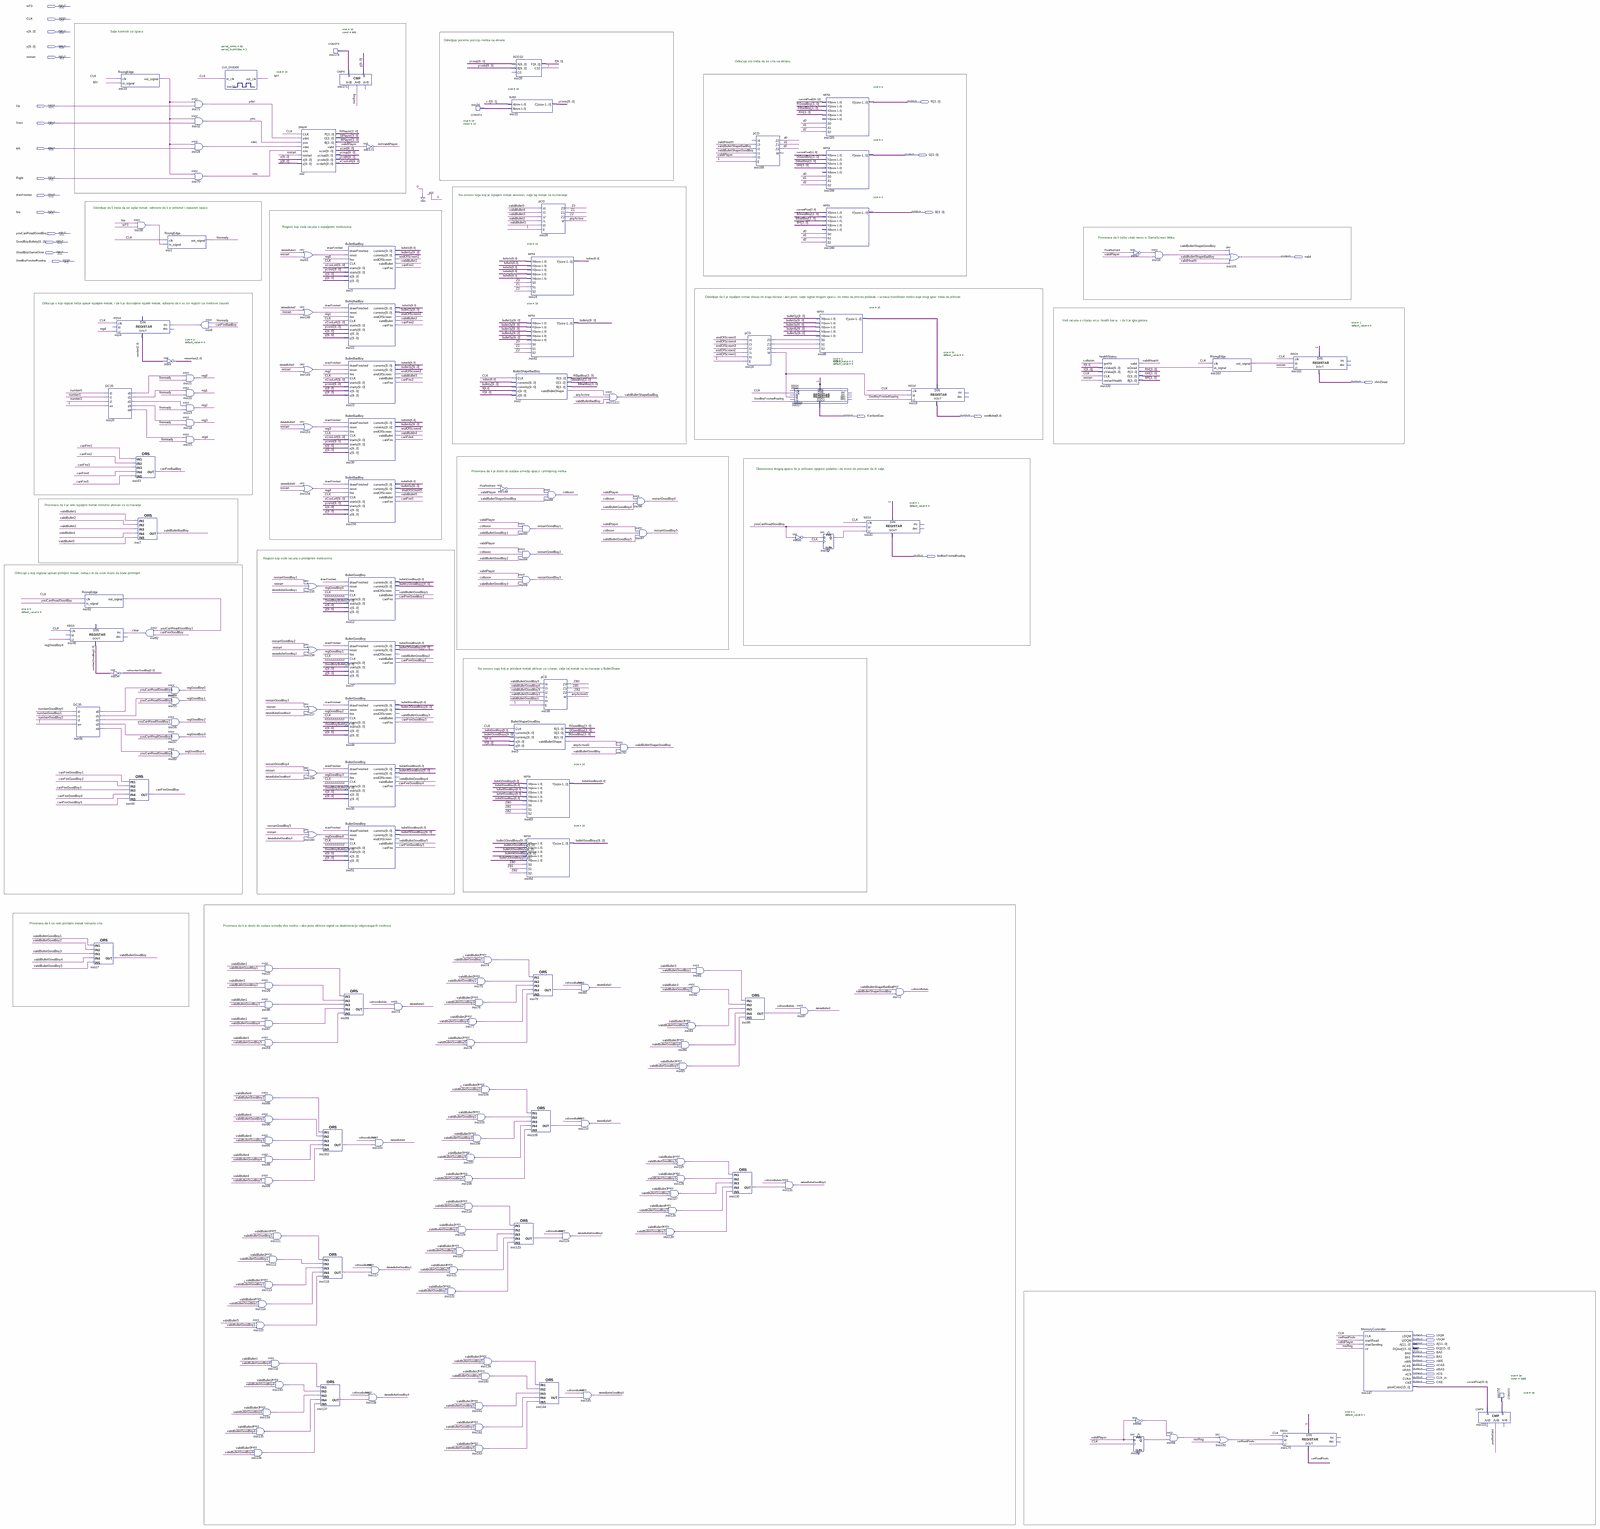
[diagram p0: schematic sheet, whole]
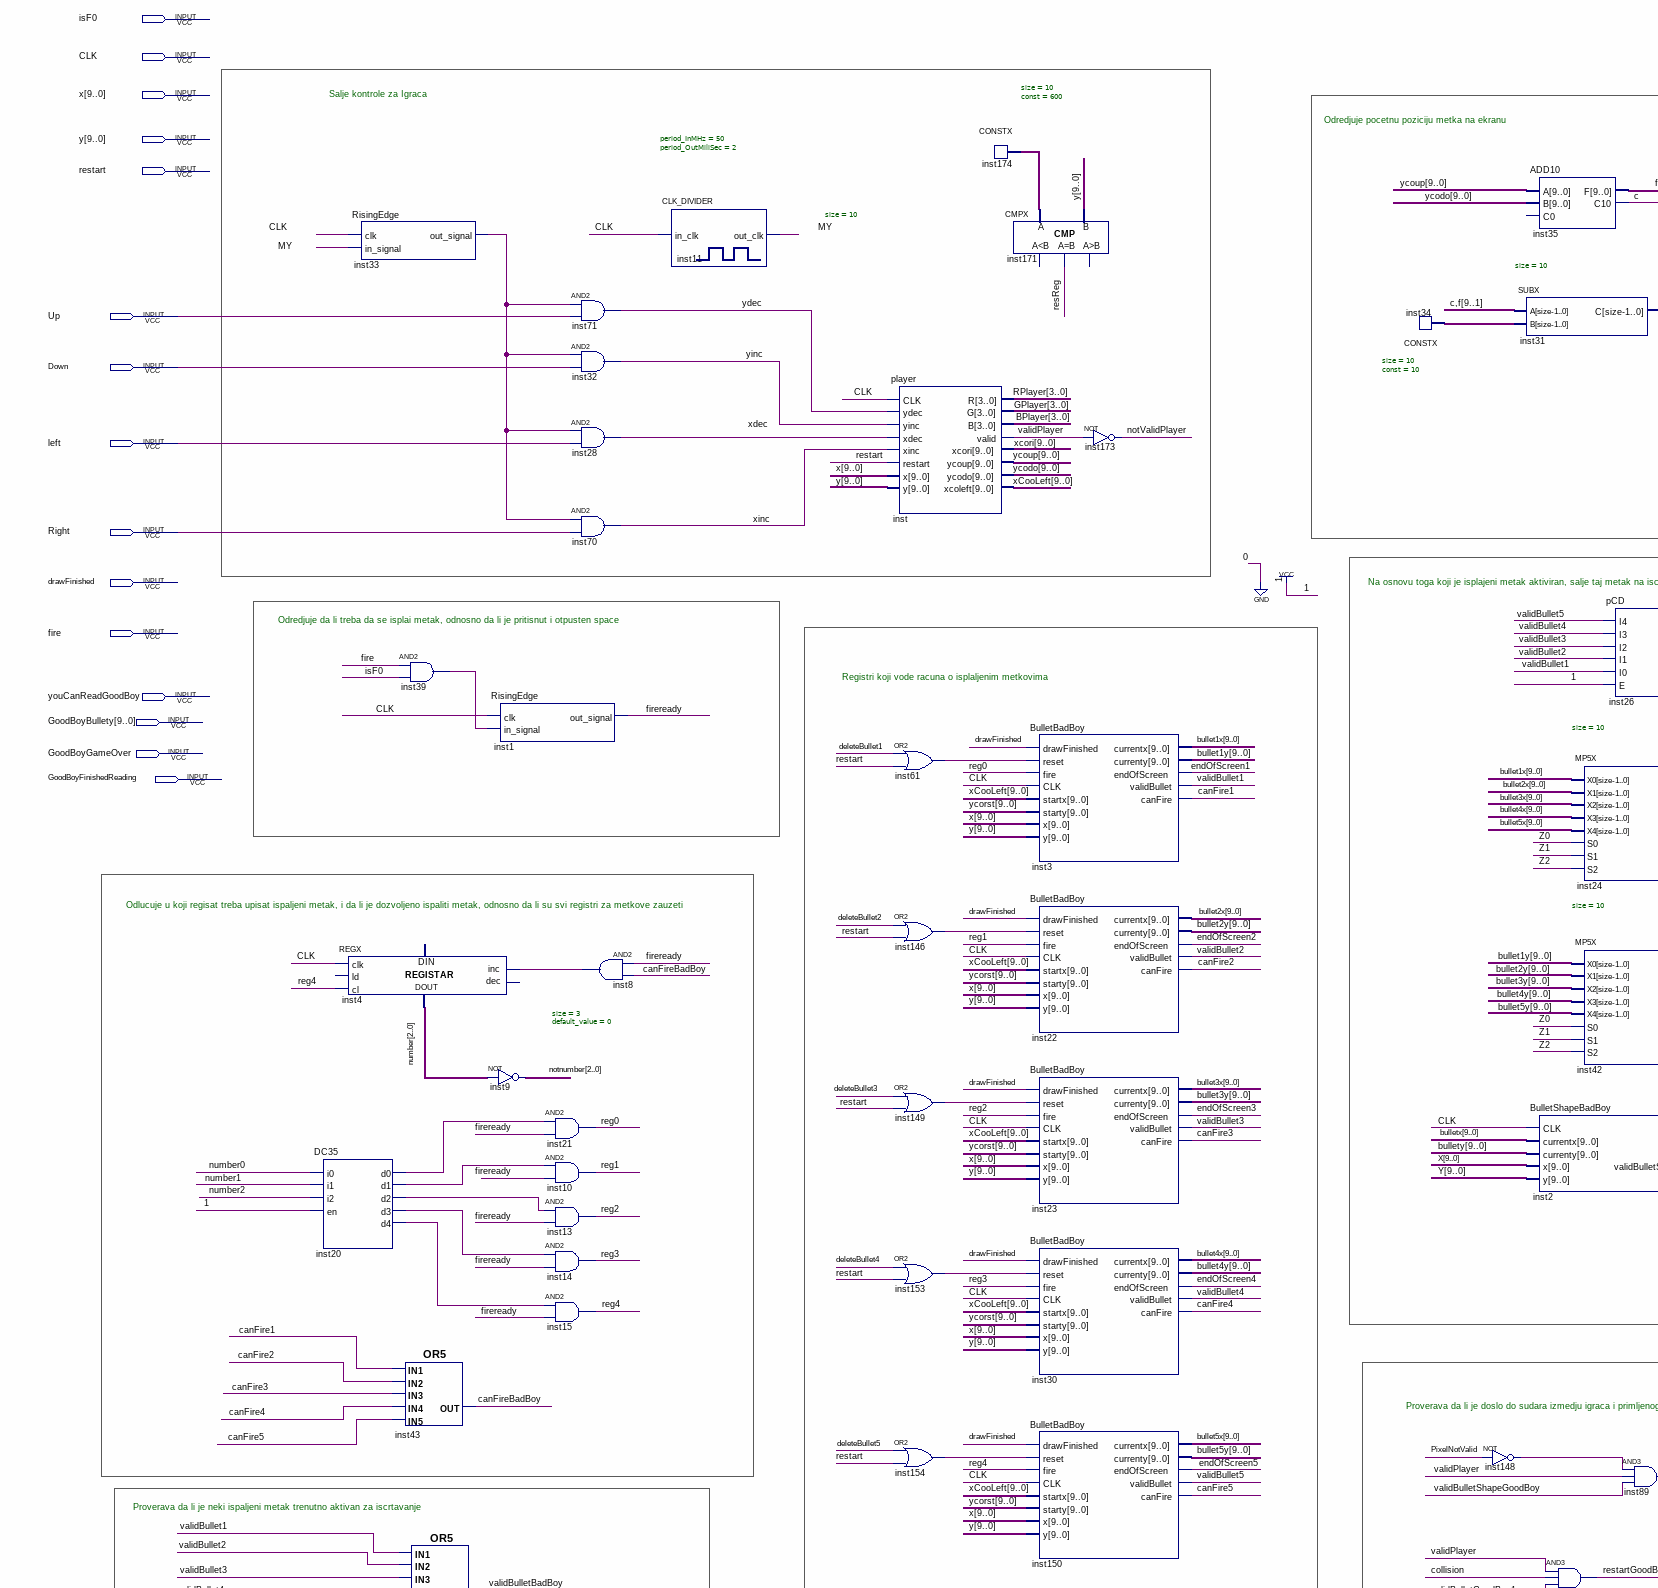
[diagram p1: schematic sheet, upper left part]
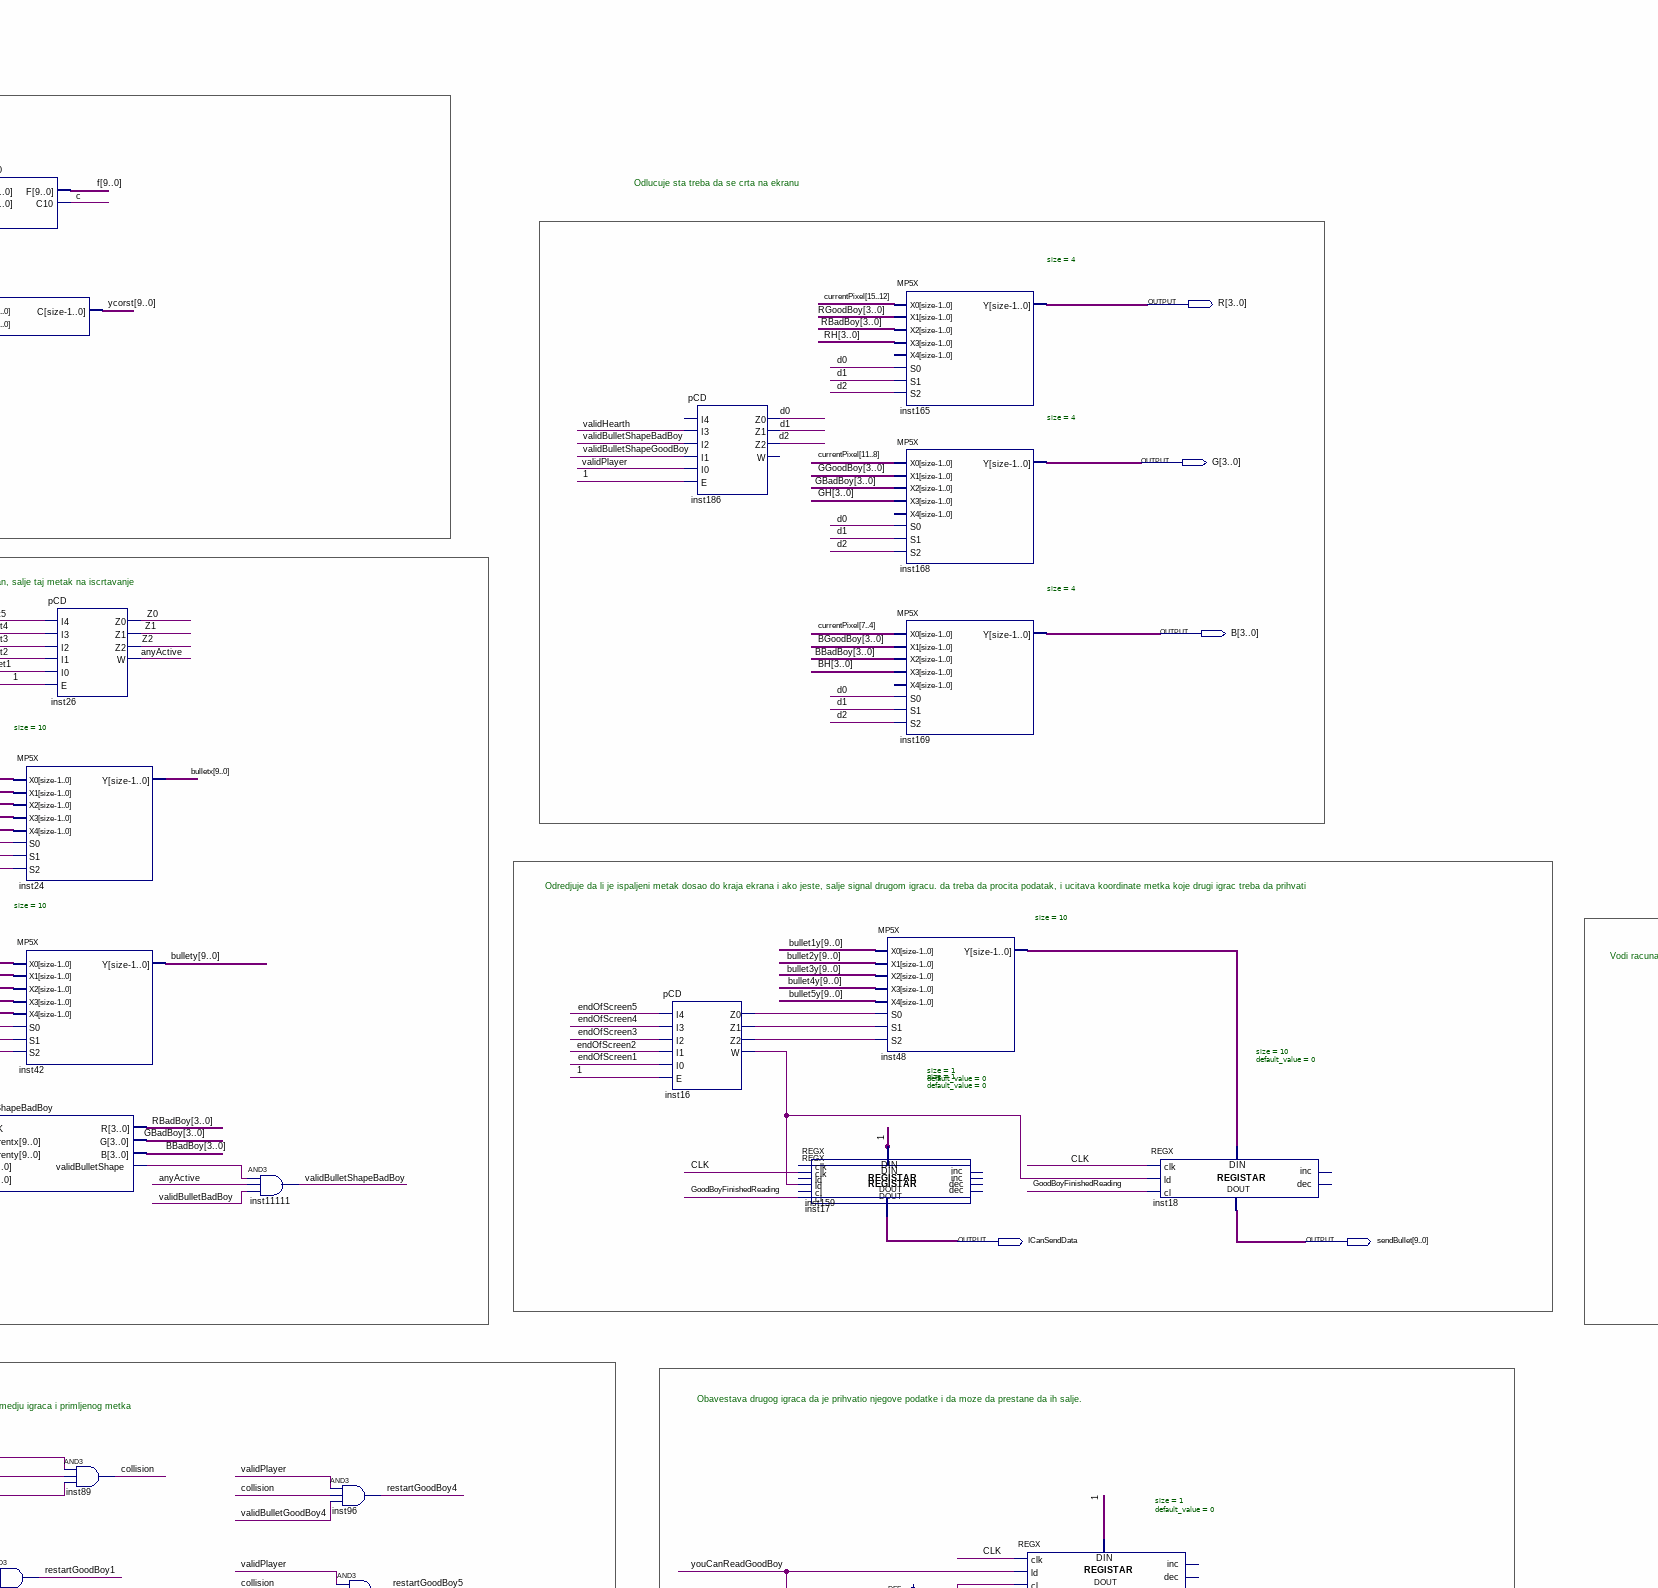
[diagram p2: schematic sheet, upper centre part]
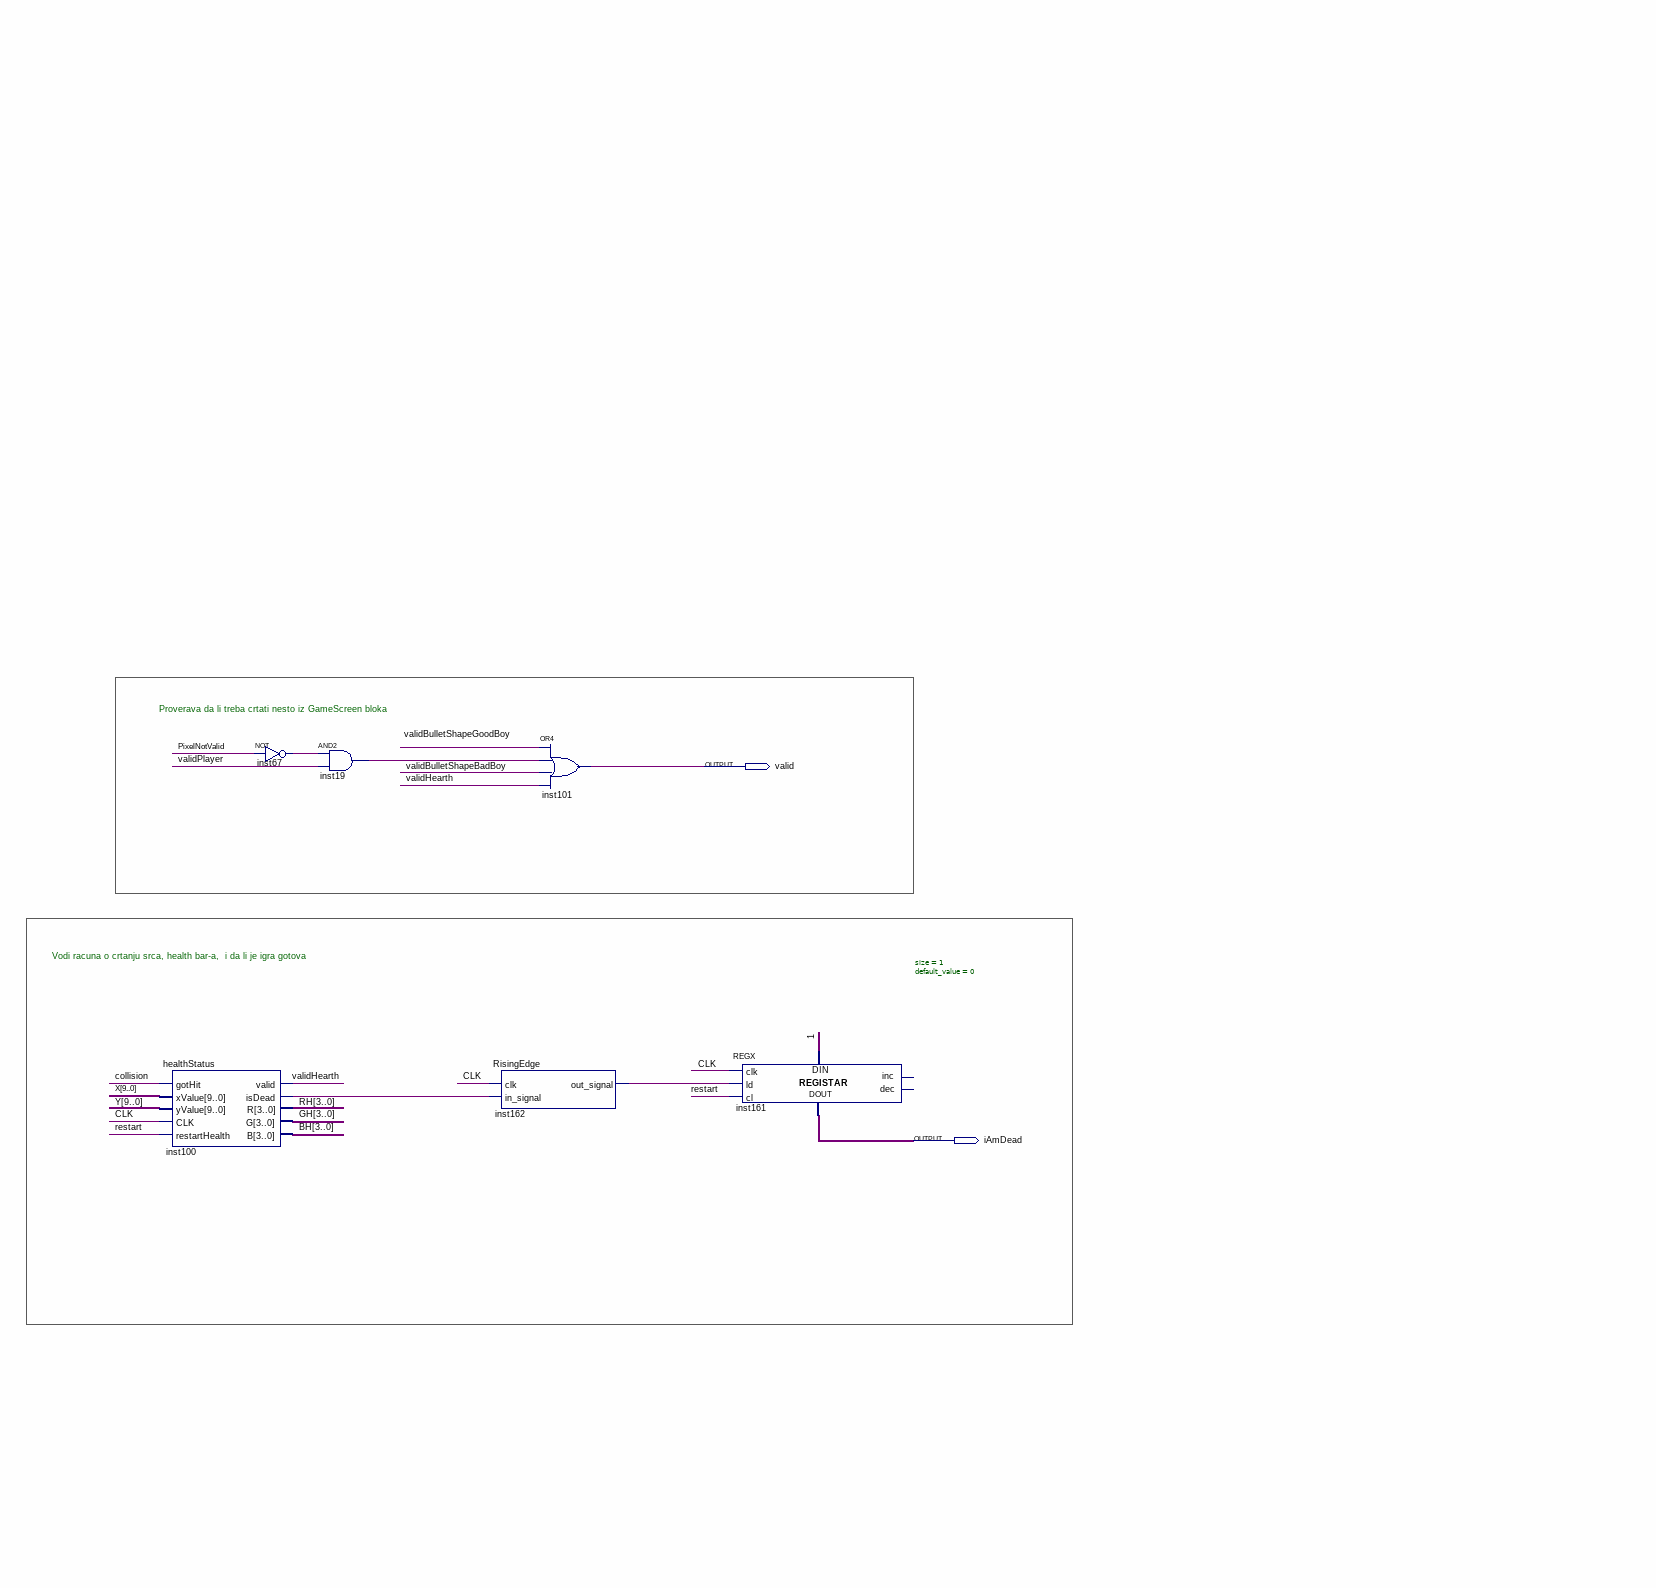
[diagram p3: schematic sheet, upper right part]
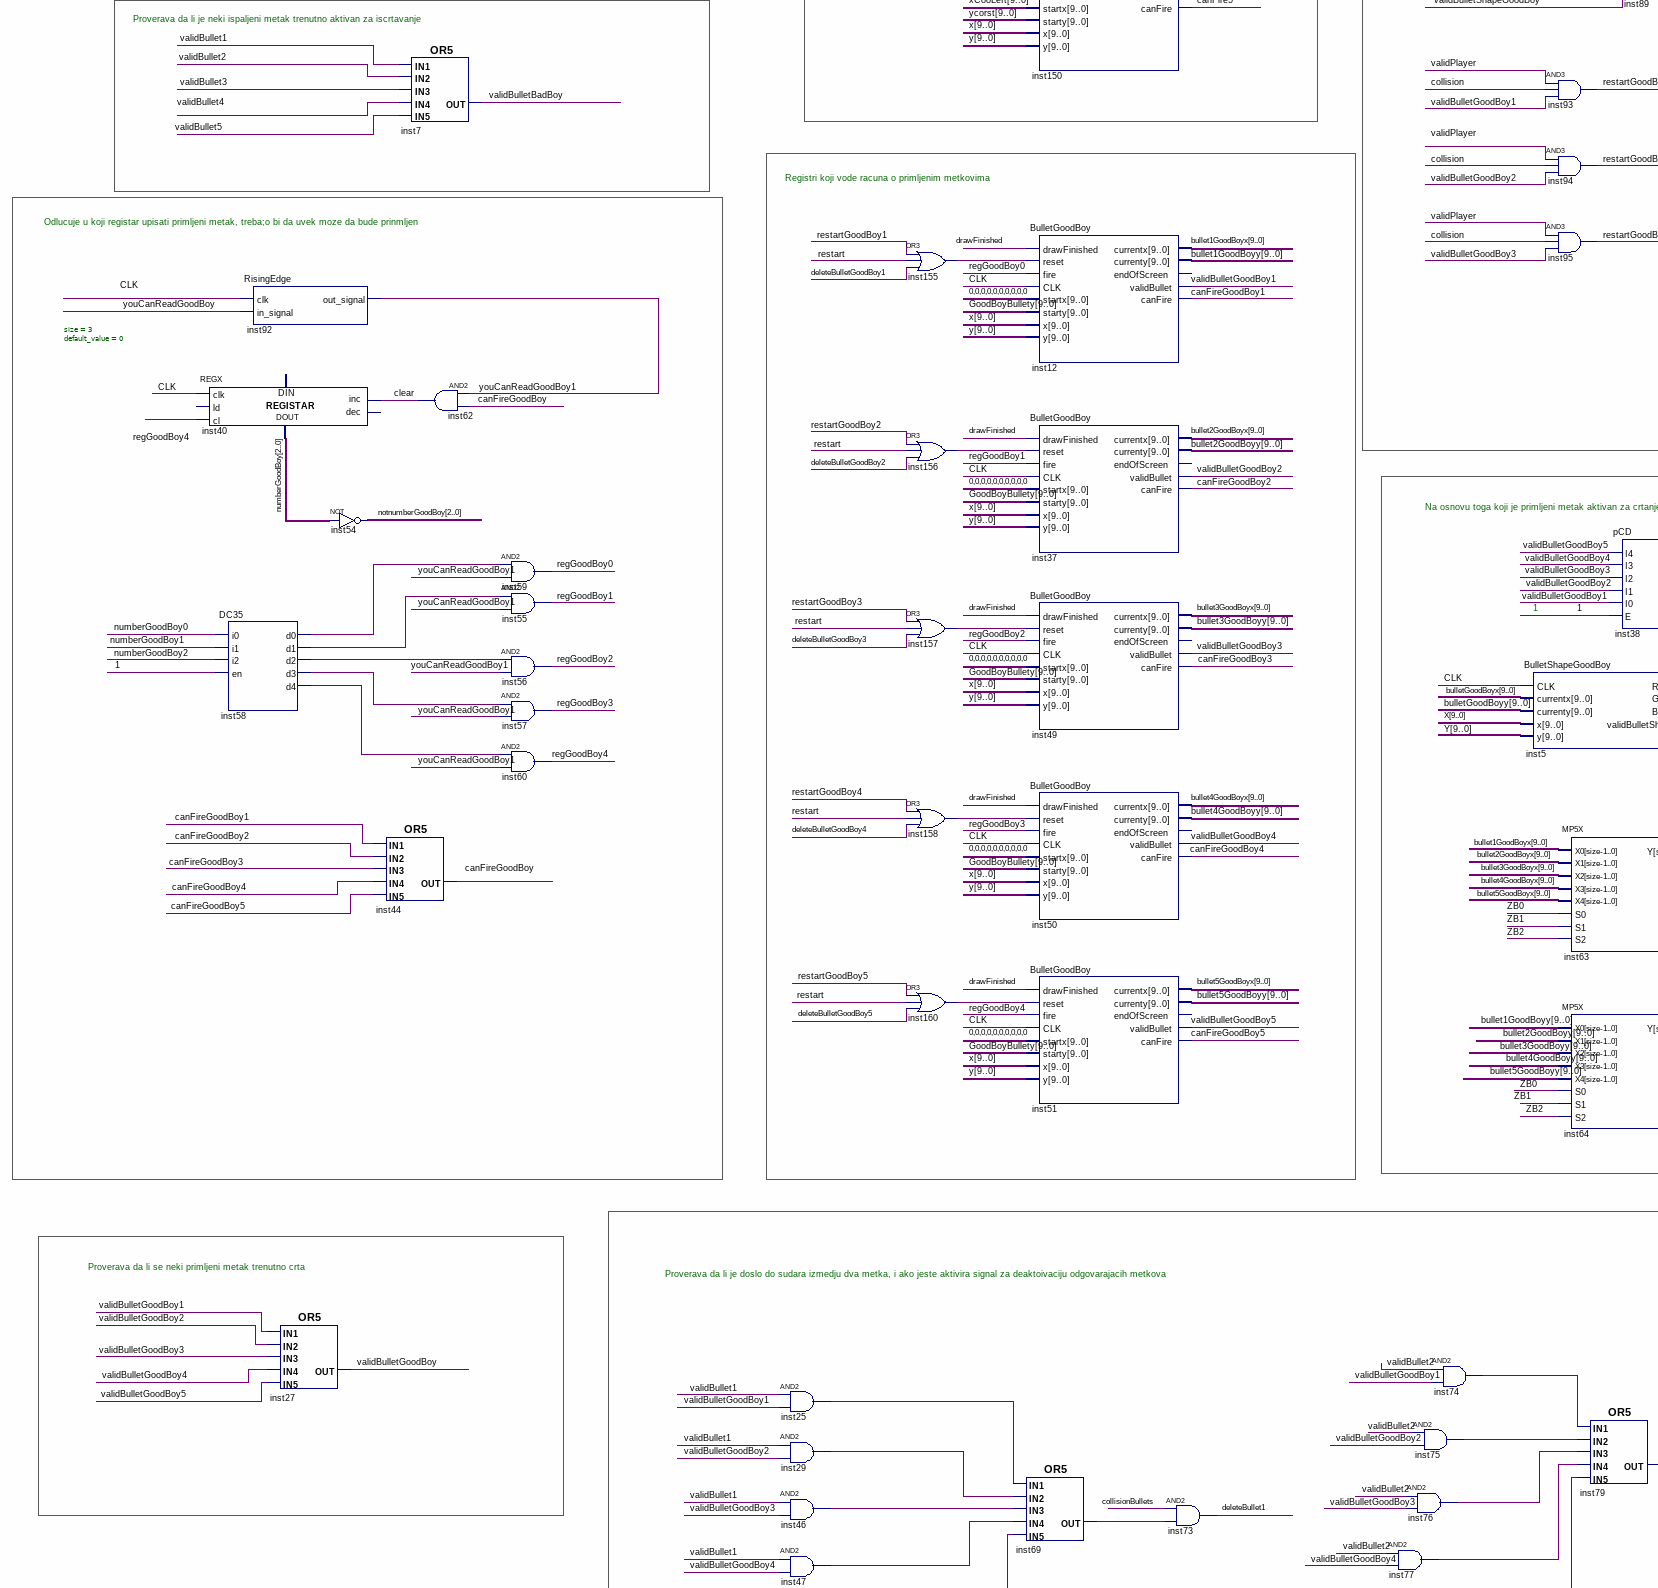
[diagram p4: schematic sheet, middle left part]
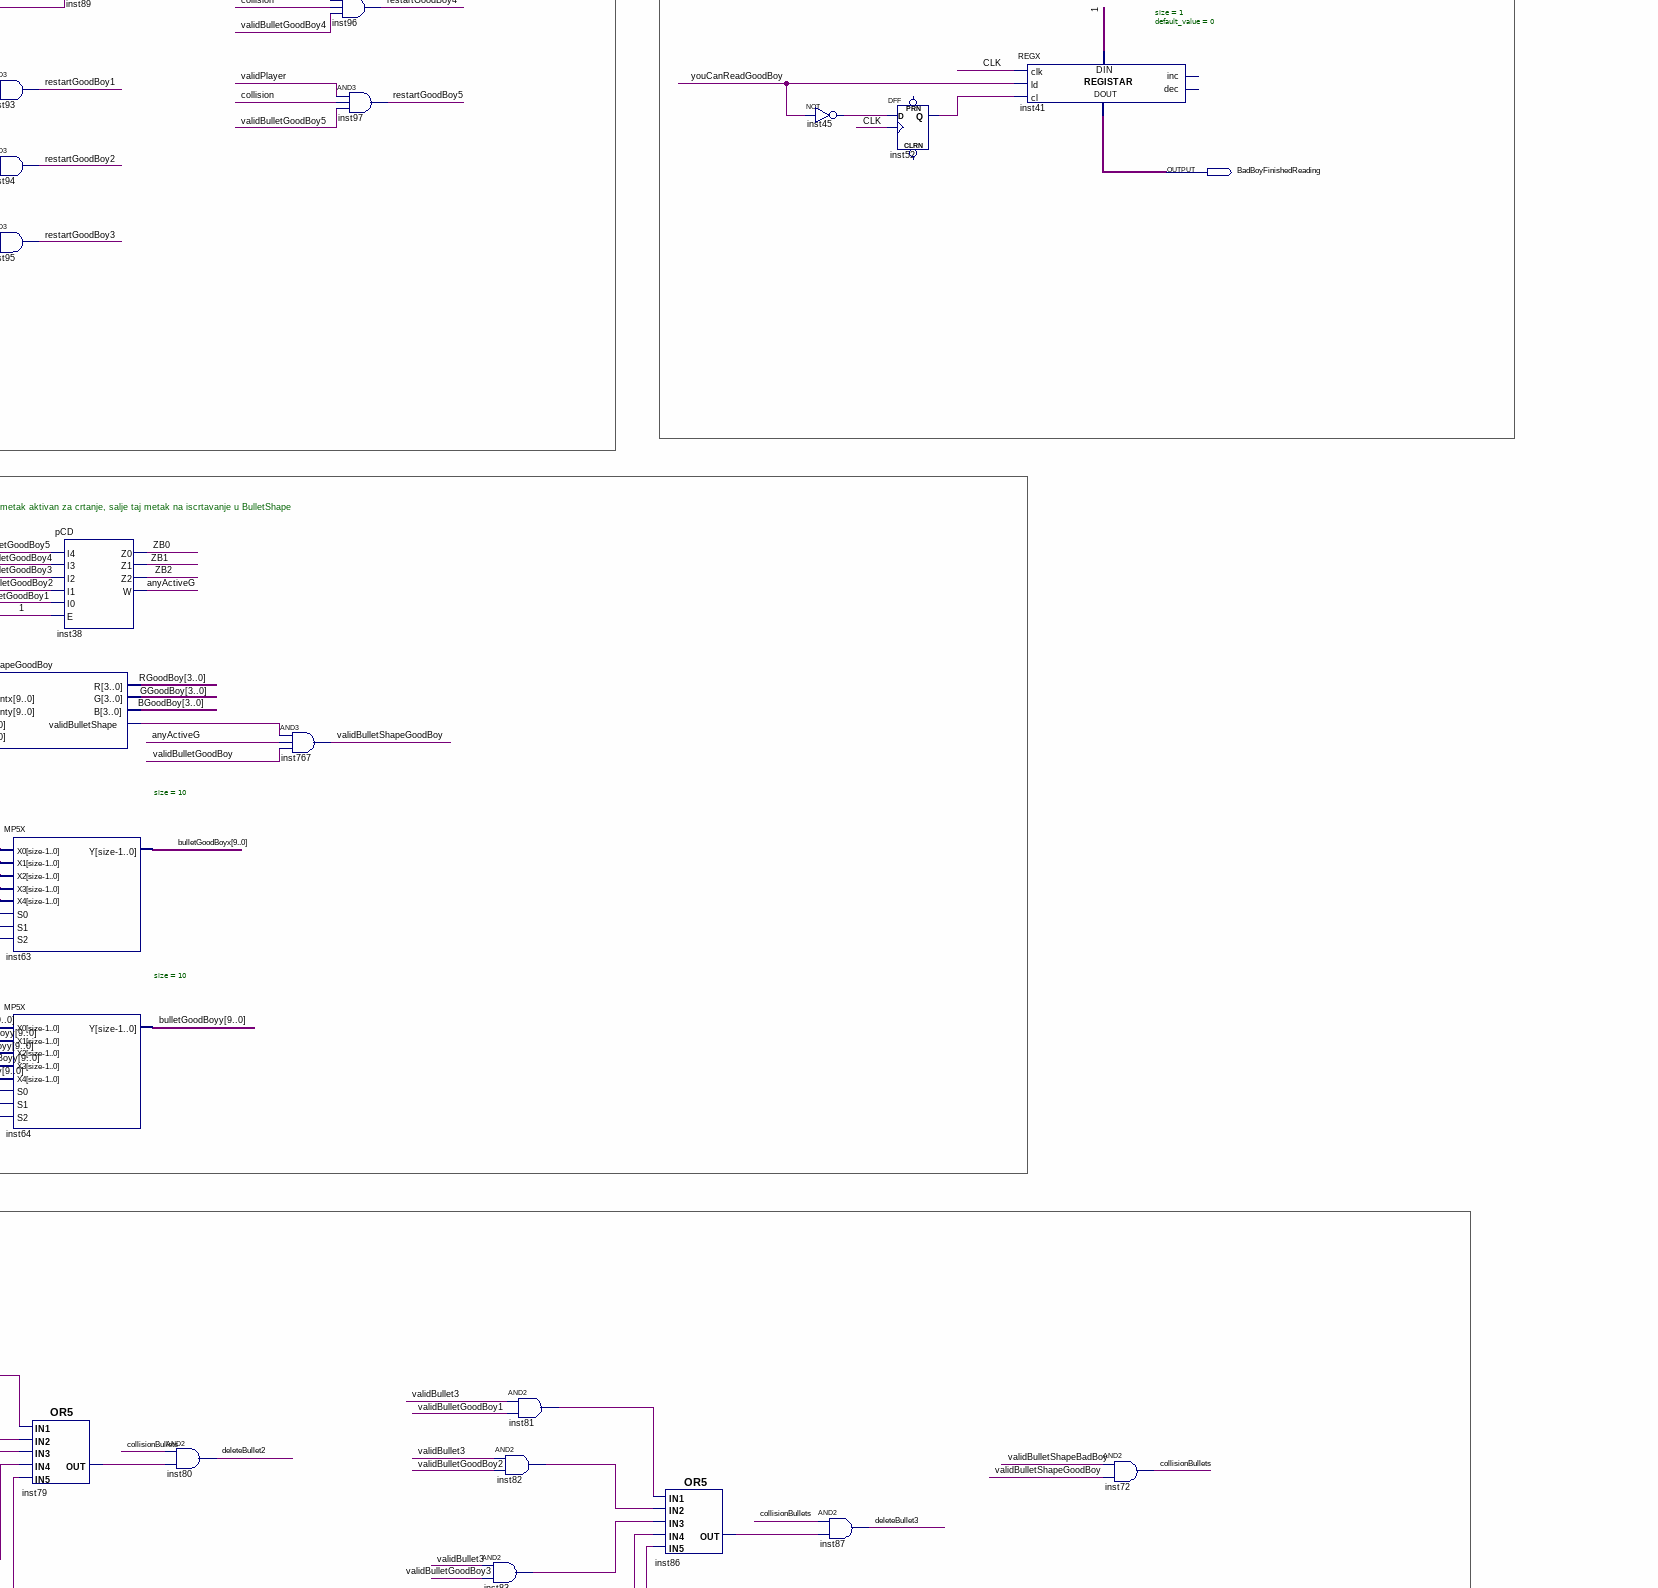
[diagram p5: schematic sheet, middle centre part]
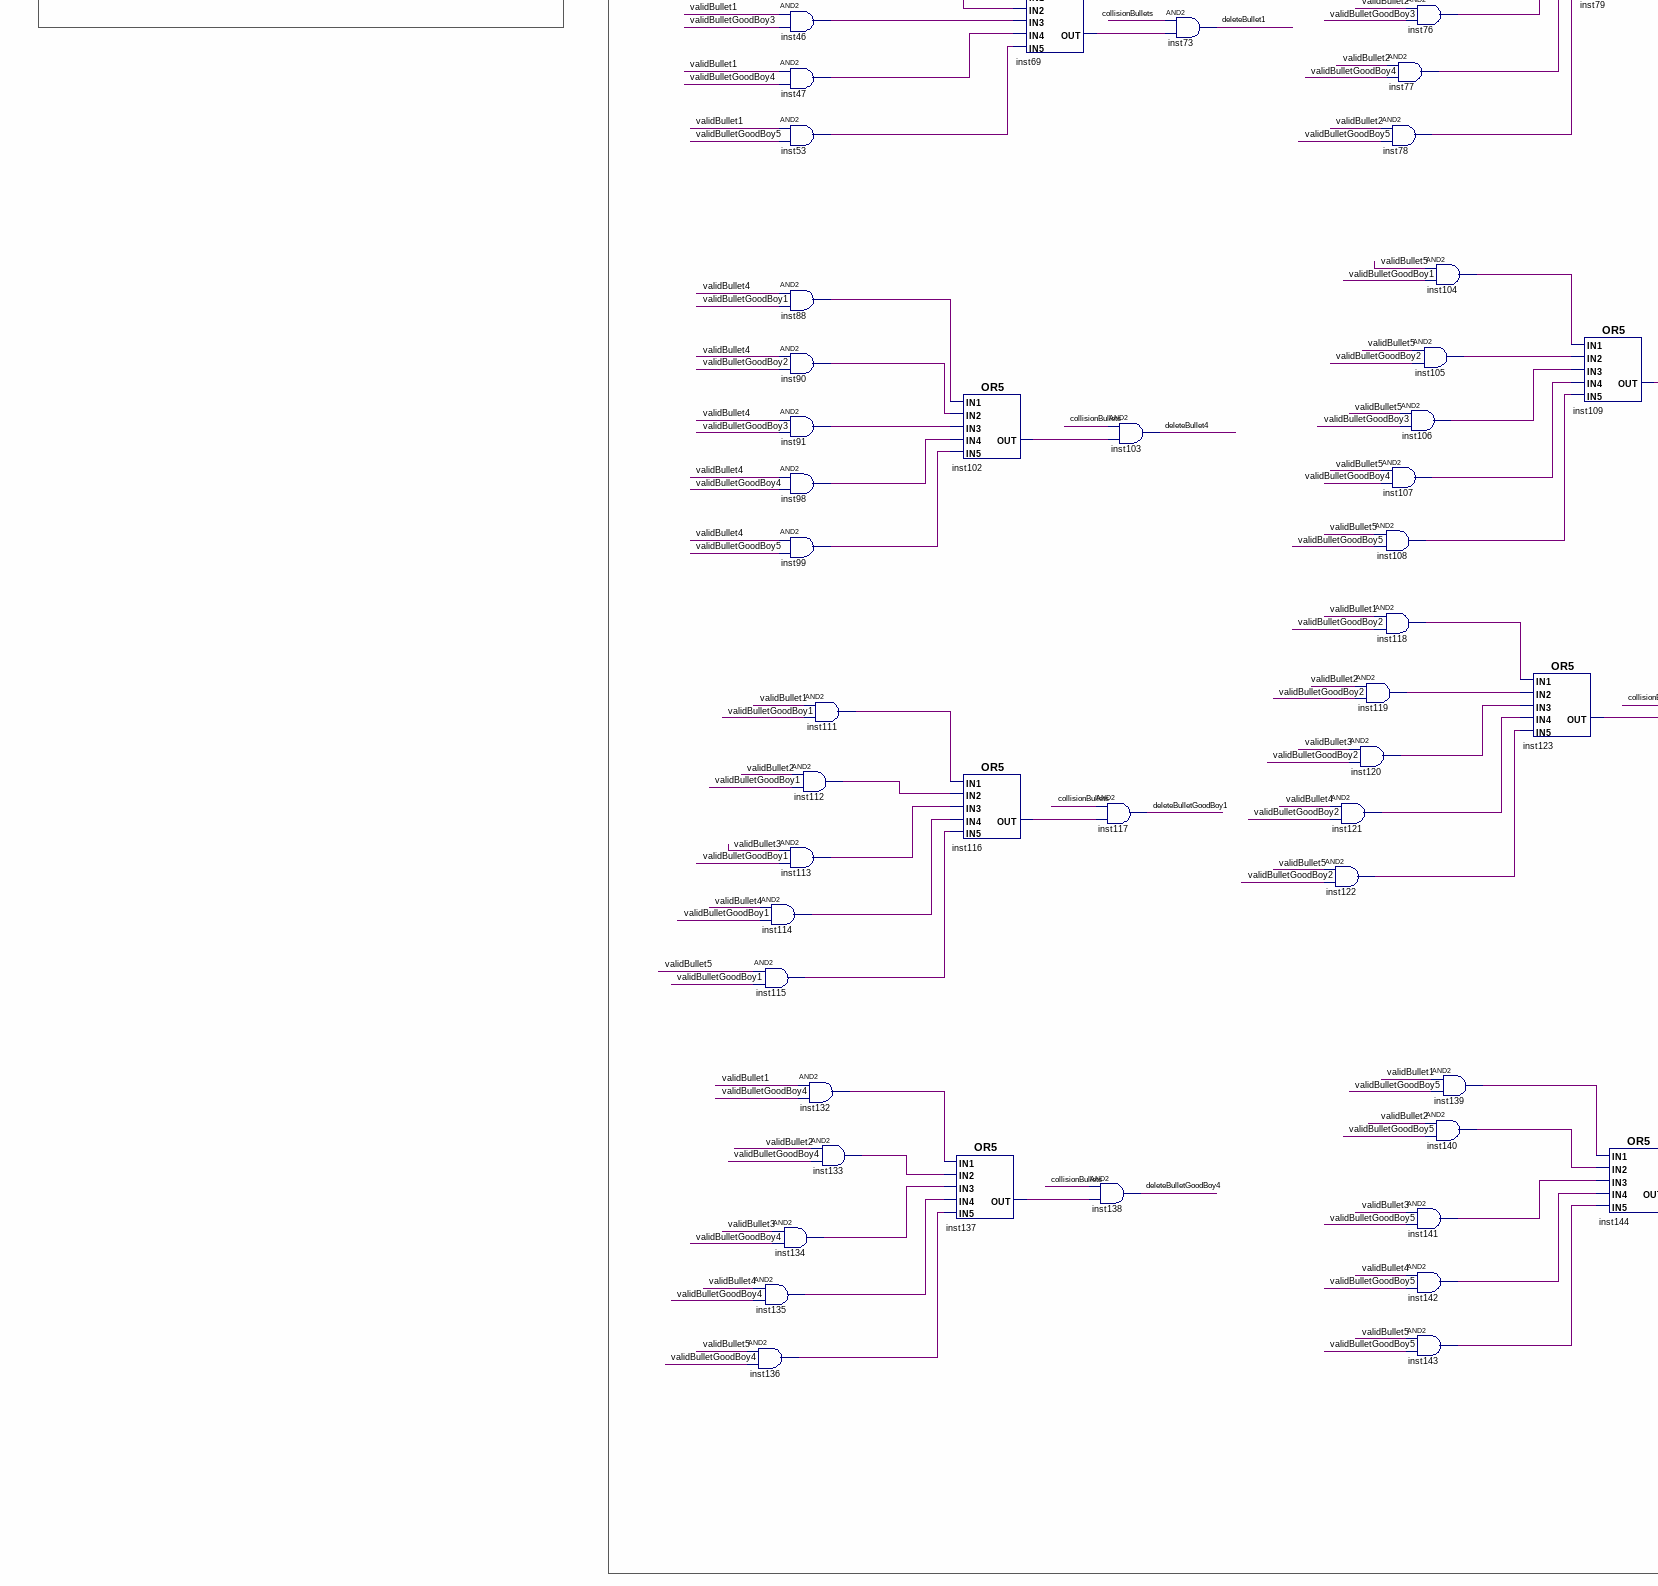
[diagram p6: schematic sheet, lower left part]
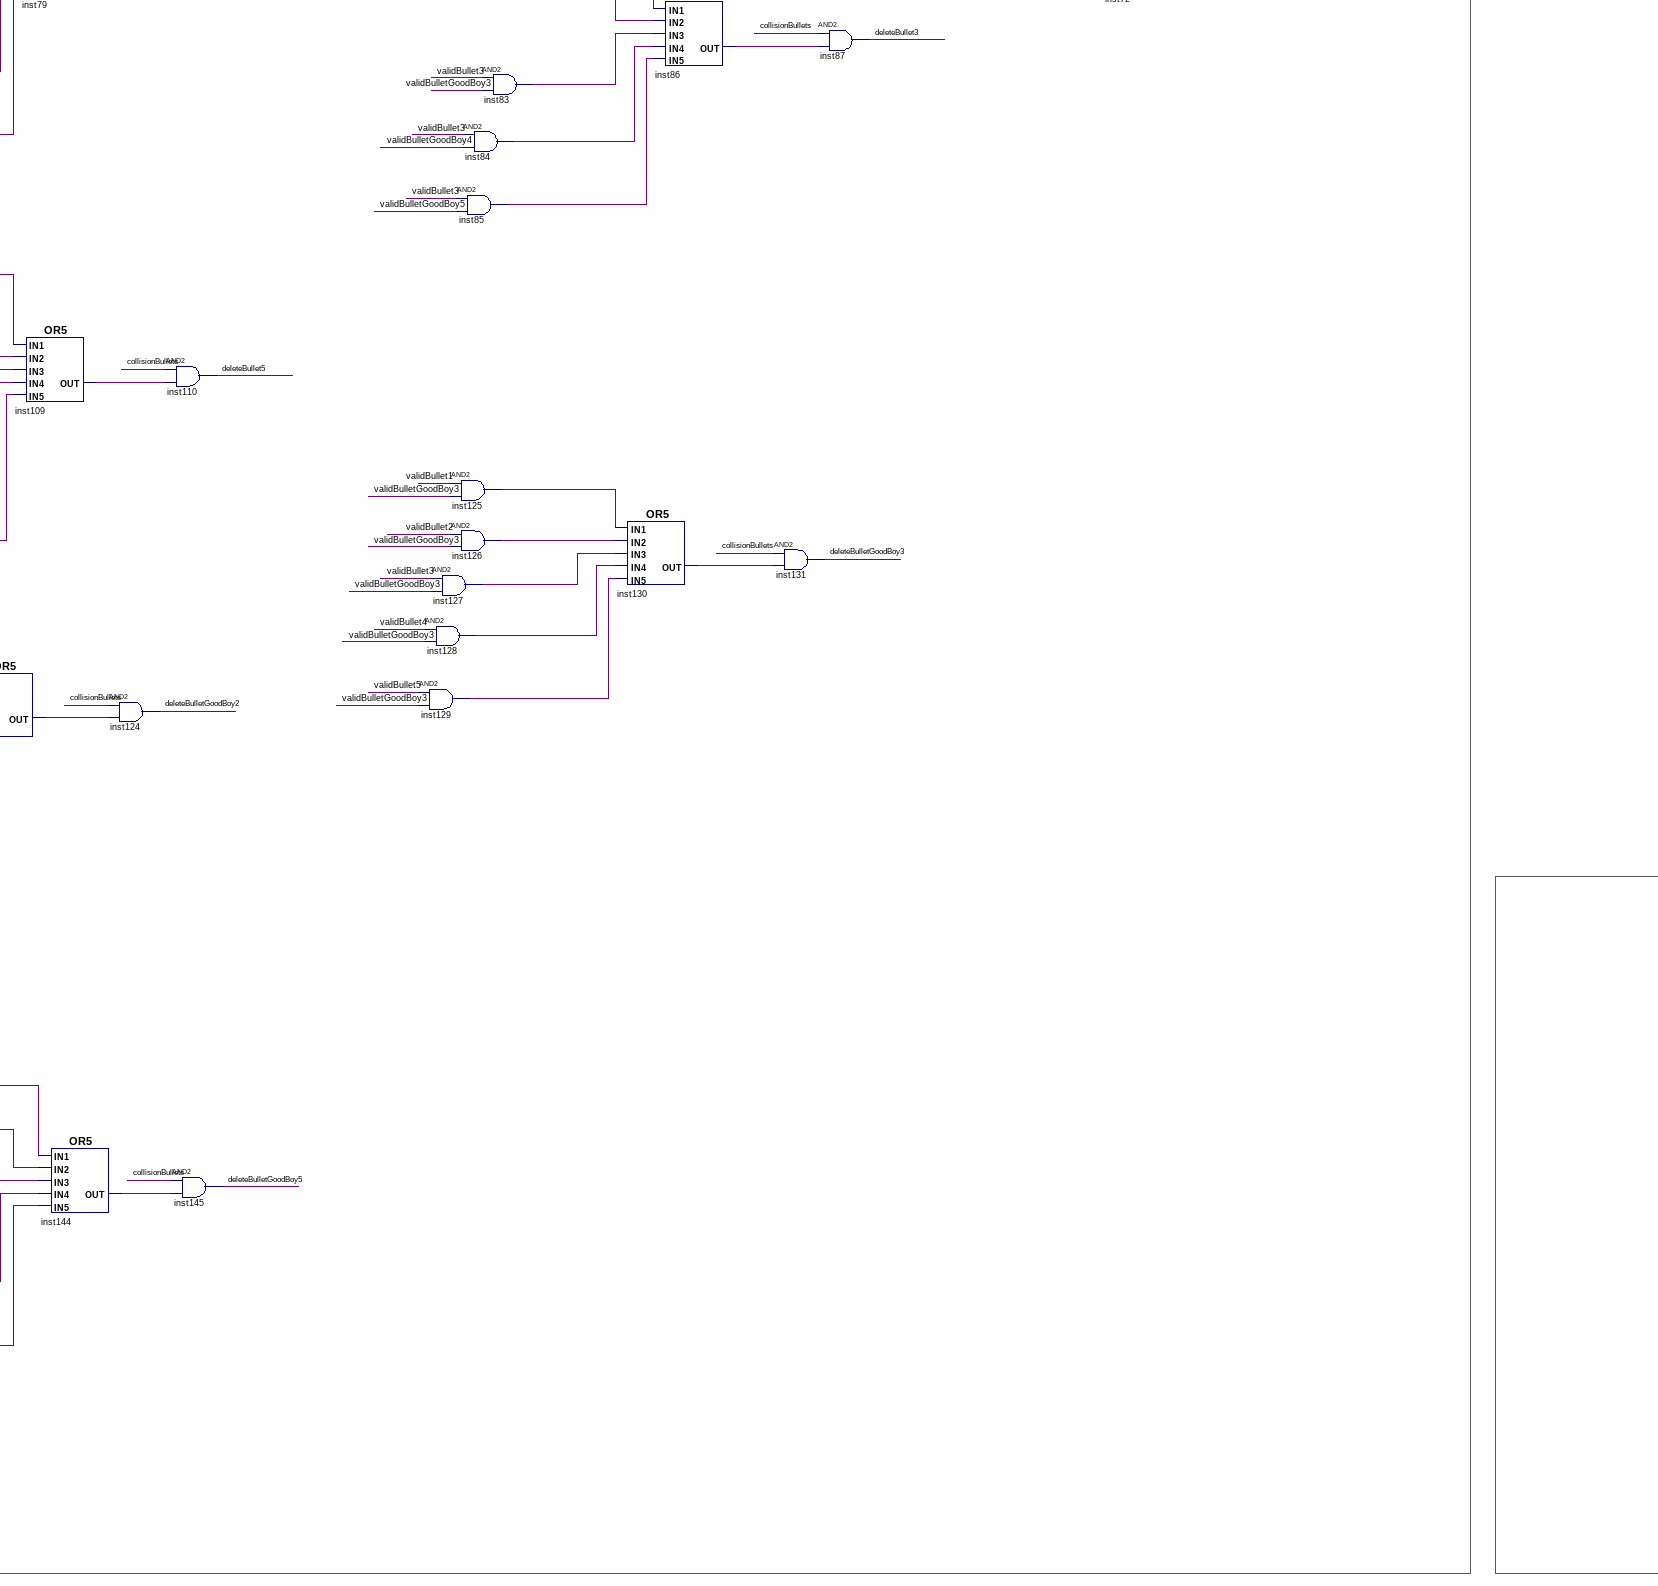
[diagram p7: schematic sheet, lower centre part]
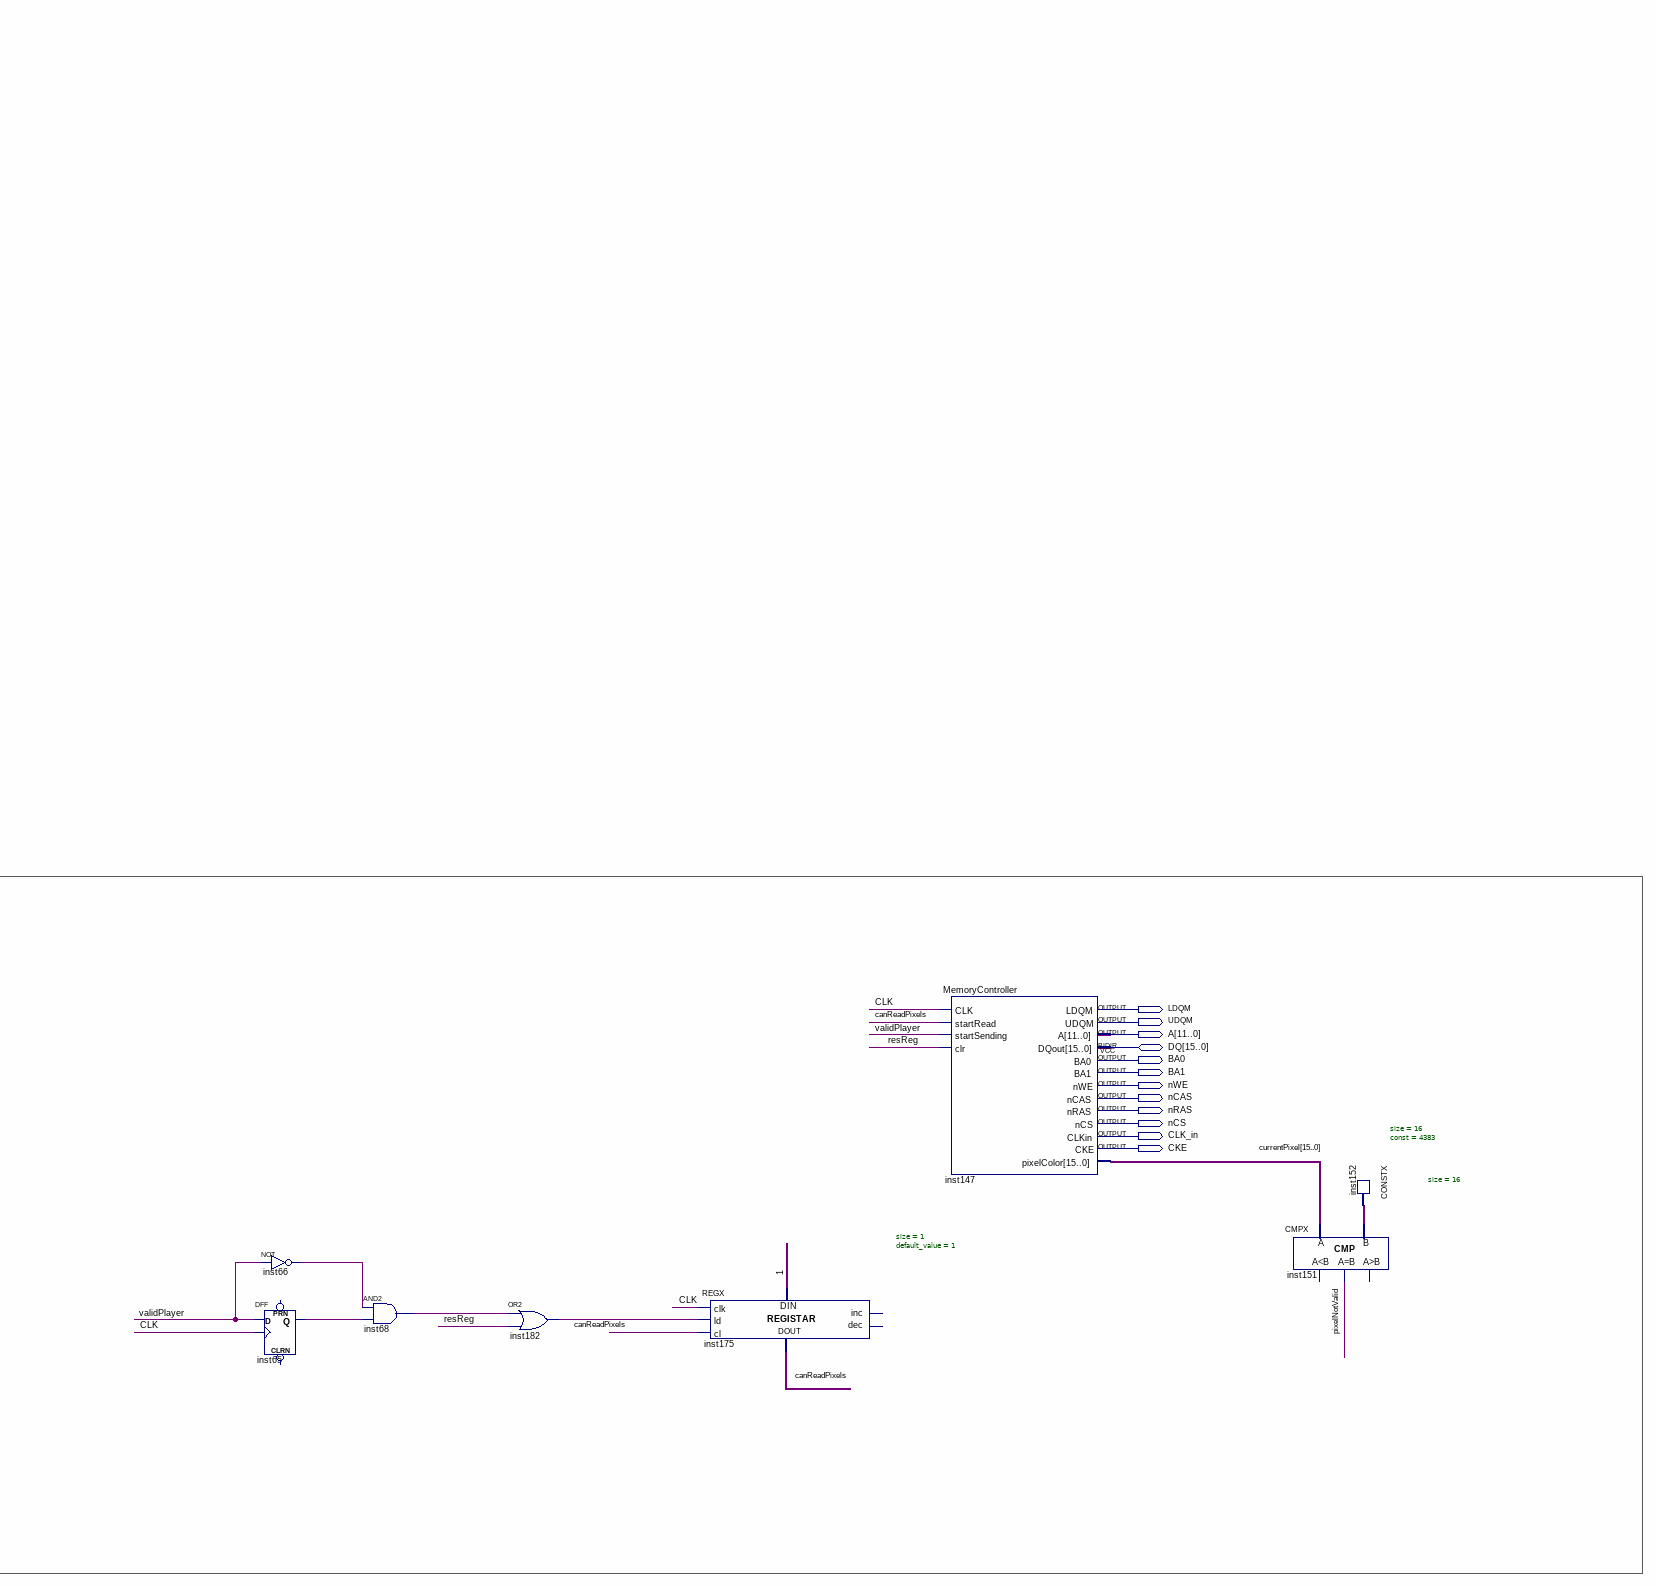
[diagram p8: schematic sheet, lower right part]
// Quartus schematic gameScreen.bdf as structural Verilog: 172 symbols, 35 pins
module gameScreen (
  input  isF0,
  input  CLK,
  input  [9:0] x,
  input  [9:0] y,
  input  restart,
  input  Up,
  input  Down,
  input  left,
  input  Right,
  input  drawFinished,
  input  fire,
  input  youCanReadGoodBoy,
  input  [9:0] GoodBoyBullety,
  input  GoodBoyGameOver,
  input  GoodBoyFinishedReading,
  inout  [15:0] DQ,
  output [3:0] R,
  output [3:0] G,
  output [3:0] B,
  output valid,
  output iAmDead,
  output ICanSendData,
  output [9:0] sendBullet,
  output BadBoyFinishedReading,
  output LDQM,
  output UDQM,
  output [11:0] A,
  output BA0,
  output BA1,
  output nWE,
  output nCAS,
  output nRAS,
  output nCS,
  output CLK_in,
  output CKE
);

  wire anyActive, anyActiveG, c, canFire1, canFire2, canFire3, canFire4, canFire5, canFireBadBoy,
       canFireGoodBoy, canFireGoodBoy1, canFireGoodBoy2, canFireGoodBoy3, canFireGoodBoy4, canFireGoodBoy5,
       canReadPixels, clear, collision, collisionBullets, d0, d1, d2, deleteBullet1, deleteBullet2,
       deleteBullet3, deleteBullet4, deleteBullet5, deleteBulletGoodBoy1, deleteBulletGoodBoy2,
       deleteBulletGoodBoy3, deleteBulletGoodBoy4, deleteBulletGoodBoy5, endOfScreen1, endOfScreen2,
       endOfScreen3, endOfScreen4, endOfScreen5, fireready, inst2_validbulletshape, inst5_validbulletshape,
       inst8_out, inst16_w, inst16_z0, inst16_z1, inst16_z2, inst19_out, inst20_d0, inst20_d1, inst20_d2,
       inst20_d3, inst20_d4, inst25_out, inst29_out, inst33_out_signal, inst39_out, inst45_out, inst46_out,
       inst47_out, inst52_q, inst53_out, inst58_d0, inst58_d1, inst58_d2, inst58_d3, inst58_d4, inst61_out,
       inst65_q, inst66_out, inst67_out, inst68_out, inst69_out, inst74_out, inst75_out, inst76_out,
       inst77_out, inst78_out, inst79_out, inst81_out, inst82_out, inst83_out, inst84_out, inst85_out,
       inst86_out, inst88_out, inst90_out, inst91_out, inst98_out, inst99_out, inst100_isdead, inst102_out,
       inst104_out, inst105_out, inst106_out, inst107_out, inst108_out, inst109_out, inst111_out,
       inst112_out, inst113_out, inst114_out, inst115_out, inst116_out, inst118_out, inst119_out,
       inst120_out, inst121_out, inst122_out, inst123_out, inst125_out, inst126_out, inst127_out,
       inst128_out, inst129_out, inst130_out, inst132_out, inst133_out, inst134_out, inst135_out,
       inst136_out, inst137_out, inst139_out, inst140_out, inst141_out, inst142_out, inst143_out,
       inst144_out, inst146_out, inst148_out, inst149_out, inst153_out, inst154_out, inst155_out,
       inst156_out, inst157_out, inst158_out, inst160_out, inst162_out_signal, inst182_out, MY,
       notValidPlayer, PixelNotValid, reg0, reg1, reg2, reg3, reg4, regGoodBoy0, regGoodBoy1, regGoodBoy2,
       regGoodBoy3, regGoodBoy4, resReg, restartGoodBoy1, restartGoodBoy2, restartGoodBoy3, restartGoodBoy4,
       restartGoodBoy5, validBullet1, validBullet2, validBullet3, validBullet4, validBullet5,
       validBulletBadBoy, validBulletGoodBoy, validBulletGoodBoy1, validBulletGoodBoy2, validBulletGoodBoy3,
       validBulletGoodBoy4, validBulletGoodBoy5, validBulletShapeBadBoy, validBulletShapeGoodBoy,
       validHearth, validPlayer, xdec, xinc, ydec, yinc, youCanReadGoodBoy1, Z0, Z1, Z2, ZB0, ZB1, ZB2;
  wire [2:0] notnumber, notnumberGoodBoy, number, numberGoodBoy;
  wire [3:0] BBadBoy, BGoodBoy, BH, BPlayer, GBadBoy, GGoodBoy, GH, GPlayer, RBadBoy, RGoodBoy, RH, RPlayer;
  wire [9:0] bullet1GoodBoyx, bullet1GoodBoyy, bullet1x, bullet1y, bullet2GoodBoyx, bullet2GoodBoyy,
       bullet2x, bullet2y, bullet3GoodBoyx, bullet3GoodBoyy, bullet3x, bullet3y, bullet4GoodBoyx,
       bullet4GoodBoyy, bullet4x, bullet4y, bullet5GoodBoyx, bullet5GoodBoyy, bullet5x, bullet5y,
       bulletGoodBoyx, bulletGoodBoyy, bulletx, bullety, f, inst34_data, inst48_y, inst174_data, xCooLeft,
       xcori, ycodo, ycorst, ycoup;
  wire [15:0] currentPixel, inst152_data;

  REGX #(.size(3), .default_value(0)) inst40 (
    .clk(CLK), .cl(regGoodBoy4), .inc(clear), .data_out(numberGoodBoy));  // open: ld, dec, data_in
  DC35 inst58 (
    .i0(numberGoodBoy[0]), .i1(numberGoodBoy[1]), .i2(numberGoodBoy[2]), .en(1'b1), .d0(inst58_d0),
    .d1(inst58_d1), .d2(inst58_d2), .d3(inst58_d3), .d4(inst58_d4));
  RisingEdge inst92 (.clk(CLK), .in_signal(youCanReadGoodBoy), .out_signal(youCanReadGoodBoy1));
  or inst27 (validBulletGoodBoy, validBulletGoodBoy1, validBulletGoodBoy2, validBulletGoodBoy3, validBulletGoodBoy4, validBulletGoodBoy5);
  DC35 inst20 (
    .i0(number[0]), .i1(number[1]), .i2(number[2]), .en(1'b1), .d0(inst20_d0), .d1(inst20_d1),
    .d2(inst20_d2), .d3(inst20_d3), .d4(inst20_d4));
  RisingEdge inst33 (.clk(CLK), .in_signal(MY), .out_signal(inst33_out_signal));
  REGX #(.size(3), .default_value(0)) inst4 (
    .clk(CLK), .cl(reg4), .inc(inst8_out), .data_out(number));  // open: ld, dec, data_in
  assign notnumberGoodBoy = ~numberGoodBoy;  // NOT inst54, 3 bits wide
  or inst44 (canFireGoodBoy, canFireGoodBoy1, canFireGoodBoy2, canFireGoodBoy3, canFireGoodBoy4, canFireGoodBoy5);
  and inst39 (inst39_out, fire, isF0);
  or inst43 (canFireBadBoy, canFire1, canFire2, canFire3, canFire4, canFire5);
  or inst7 (validBulletBadBoy, validBullet1, validBullet2, validBullet3, validBullet4, validBullet5);
  and inst62 (clear, youCanReadGoodBoy1, canFireGoodBoy);
  RisingEdge inst1 (.clk(CLK), .in_signal(inst39_out), .out_signal(fireready));
  assign notnumber = ~number;  // NOT inst9, 3 bits wide
  and inst59 (regGoodBoy0, inst58_d0, youCanReadGoodBoy1);
  and inst55 (regGoodBoy1, inst58_d1, youCanReadGoodBoy1);
  and inst56 (regGoodBoy2, inst58_d2, youCanReadGoodBoy1);
  and inst57 (regGoodBoy3, inst58_d3, youCanReadGoodBoy1);
  and inst60 (regGoodBoy4, inst58_d4, youCanReadGoodBoy1);
  and inst71 (ydec, inst33_out_signal, Up);
  and inst32 (yinc, inst33_out_signal, Down);
  and inst28 (xdec, inst33_out_signal, left);
  and inst70 (xinc, inst33_out_signal, Right);
  and inst21 (reg0, inst20_d0, fireready);
  and inst10 (reg1, inst20_d1, fireready);
  and inst13 (reg2, inst20_d2, fireready);
  and inst14 (reg3, inst20_d3, fireready);
  and inst15 (reg4, inst20_d4, fireready);
  and inst8 (inst8_out, fireready, canFireBadBoy);
  CLK_DIVIDER #(.period_InMHz(50), .period_OutMiliSec(2)) inst11 (.in_clk(CLK), .out_clk(MY));
  and inst25 (inst25_out, validBullet1, validBulletGoodBoy1);
  and inst29 (inst29_out, validBullet1, validBulletGoodBoy2);
  and inst46 (inst46_out, validBullet1, validBulletGoodBoy3);
  and inst47 (inst47_out, validBullet1, validBulletGoodBoy4);
  and inst53 (inst53_out, validBullet1, validBulletGoodBoy5);
  and inst88 (inst88_out, validBullet4, validBulletGoodBoy1);
  and inst90 (inst90_out, validBullet4, validBulletGoodBoy2);
  and inst91 (inst91_out, validBullet4, validBulletGoodBoy3);
  and inst98 (inst98_out, validBullet4, validBulletGoodBoy4);
  and inst99 (inst99_out, validBullet4, validBulletGoodBoy5);
  and inst113 (inst113_out, validBullet3, validBulletGoodBoy1);
  and inst114 (inst114_out, validBullet4, validBulletGoodBoy1);
  and inst115 (inst115_out, validBullet5, validBulletGoodBoy1);
  and inst134 (inst134_out, validBullet3, validBulletGoodBoy4);
  and inst135 (inst135_out, validBullet4, validBulletGoodBoy4);
  and inst136 (inst136_out, validBullet5, validBulletGoodBoy4);
  and inst111 (inst111_out, validBullet1, validBulletGoodBoy1);
  and inst112 (inst112_out, validBullet2, validBulletGoodBoy1);
  and inst132 (inst132_out, validBullet1, validBulletGoodBoy4);
  and inst133 (inst133_out, validBullet2, validBulletGoodBoy4);
  player inst (
    .CLK(CLK), .ydec(ydec), .yinc(yinc), .xdec(xdec), .xinc(xinc), .restart(restart), .x(x), .y(y),
    .R(RPlayer), .G(GPlayer), .B(BPlayer), .valid(validPlayer), .xcori(xcori), .ycoup(ycoup), .ycodo(ycodo),
    .xcoleft(xCooLeft));
  or inst61 (inst61_out, deleteBullet1, restart);
  or inst146 (inst146_out, deleteBullet2, restart);
  or inst149 (inst149_out, deleteBullet3, restart);
  or inst153 (inst153_out, deleteBullet4, restart);
  or inst154 (inst154_out, deleteBullet5, restart);
  or inst155 (inst155_out, restartGoodBoy1, restart, deleteBulletGoodBoy1);
  or inst156 (inst156_out, restartGoodBoy2, restart, deleteBulletGoodBoy2);
  or inst157 (inst157_out, restartGoodBoy3, restart, deleteBulletGoodBoy3);
  or inst158 (inst158_out, restartGoodBoy4, restart, deleteBulletGoodBoy4);
  or inst160 (inst160_out, restartGoodBoy5, restart, deleteBulletGoodBoy5);
  CONSTX #(.size(10), .\const (600)) inst174 (.data(inst174_data));
  or inst102 (inst102_out, inst88_out, inst90_out, inst91_out, inst98_out, inst99_out);
  or inst116 (inst116_out, inst111_out, inst112_out, inst113_out, inst114_out, inst115_out);
  or inst137 (inst137_out, inst132_out, inst133_out, inst134_out, inst135_out, inst136_out);
  CMPX #(.size(10)) inst171 (.A(inst174_data), .B(y), .eq(resReg));  // open: ls, gr
  BulletBadBoy inst3 (
    .drawFinished(drawFinished), .reset(inst61_out), .fire(reg0), .CLK(CLK), .startx(xCooLeft),
    .starty(ycorst), .x(x), .y(y), .currentx(bullet1x), .currenty(bullet1y), .endOfScreen(endOfScreen1),
    .validBullet(validBullet1), .canFire(canFire1));
  BulletBadBoy inst22 (
    .drawFinished(drawFinished), .reset(inst146_out), .fire(reg1), .CLK(CLK), .startx(xCooLeft),
    .starty(ycorst), .x(x), .y(y), .currentx(bullet2x), .currenty(bullet2y), .endOfScreen(endOfScreen2),
    .validBullet(validBullet2), .canFire(canFire2));
  BulletBadBoy inst23 (
    .drawFinished(drawFinished), .reset(inst149_out), .fire(reg2), .CLK(CLK), .startx(xCooLeft),
    .starty(ycorst), .x(x), .y(y), .currentx(bullet3x), .currenty(bullet3y), .endOfScreen(endOfScreen3),
    .validBullet(validBullet3), .canFire(canFire3));
  BulletBadBoy inst30 (
    .drawFinished(drawFinished), .reset(inst153_out), .fire(reg3), .CLK(CLK), .startx(xCooLeft),
    .starty(ycorst), .x(x), .y(y), .currentx(bullet4x), .currenty(bullet4y), .endOfScreen(endOfScreen4),
    .validBullet(validBullet4), .canFire(canFire4));
  BulletBadBoy inst150 (
    .drawFinished(drawFinished), .reset(inst154_out), .fire(reg4), .CLK(CLK), .startx(xCooLeft),
    .starty(ycorst), .x(x), .y(y), .currentx(bullet5x), .currenty(bullet5y), .endOfScreen(endOfScreen5),
    .validBullet(validBullet5), .canFire(canFire5));
  BulletGoodBoy inst12 (
    .drawFinished(drawFinished), .reset(inst155_out), .fire(regGoodBoy0), .CLK(CLK), .startx({10{1'b0}}),
    .starty(GoodBoyBullety), .x(x), .y(y), .currentx(bullet1GoodBoyx), .currenty(bullet1GoodBoyy),
    .validBullet(validBulletGoodBoy1), .canFire(canFireGoodBoy1));  // open: endOfScreen
  BulletGoodBoy inst37 (
    .drawFinished(drawFinished), .reset(inst156_out), .fire(regGoodBoy1), .CLK(CLK), .startx({10{1'b0}}),
    .starty(GoodBoyBullety), .x(x), .y(y), .currentx(bullet2GoodBoyx), .currenty(bullet2GoodBoyy),
    .validBullet(validBulletGoodBoy2), .canFire(canFireGoodBoy2));  // open: endOfScreen
  BulletGoodBoy inst49 (
    .drawFinished(drawFinished), .reset(inst157_out), .fire(regGoodBoy2), .CLK(CLK), .startx({10{1'b0}}),
    .starty(GoodBoyBullety), .x(x), .y(y), .currentx(bullet3GoodBoyx), .currenty(bullet3GoodBoyy),
    .validBullet(validBulletGoodBoy3), .canFire(canFireGoodBoy3));  // open: endOfScreen
  BulletGoodBoy inst50 (
    .drawFinished(drawFinished), .reset(inst158_out), .fire(regGoodBoy3), .CLK(CLK), .startx({10{1'b0}}),
    .starty(GoodBoyBullety), .x(x), .y(y), .currentx(bullet4GoodBoyx), .currenty(bullet4GoodBoyy),
    .validBullet(validBulletGoodBoy4), .canFire(canFireGoodBoy4));  // open: endOfScreen
  BulletGoodBoy inst51 (
    .drawFinished(drawFinished), .reset(inst160_out), .fire(regGoodBoy4), .CLK(CLK), .startx({10{1'b0}}),
    .starty(GoodBoyBullety), .x(x), .y(y), .currentx(bullet5GoodBoyx), .currenty(bullet5GoodBoyy),
    .validBullet(validBulletGoodBoy5), .canFire(canFireGoodBoy5));  // open: endOfScreen
  or inst69 (inst69_out, inst25_out, inst29_out, inst46_out, inst47_out, inst53_out);
  not inst173 (notValidPlayer, validPlayer);
  and inst103 (deleteBullet4, collisionBullets, inst102_out);
  and inst117 (deleteBulletGoodBoy1, collisionBullets, inst116_out);
  and inst138 (deleteBulletGoodBoy4, collisionBullets, inst137_out);
  and inst73 (deleteBullet1, collisionBullets, inst69_out);
  and inst121 (inst121_out, validBullet4, validBulletGoodBoy2);
  and inst122 (inst122_out, validBullet5, validBulletGoodBoy2);
  and inst77 (inst77_out, validBullet2, validBulletGoodBoy4);
  and inst78 (inst78_out, validBullet2, validBulletGoodBoy5);
  and inst107 (inst107_out, validBullet5, validBulletGoodBoy4);
  and inst108 (inst108_out, validBullet5, validBulletGoodBoy5);
  and inst118 (inst118_out, validBullet1, validBulletGoodBoy2);
  and inst119 (inst119_out, validBullet2, validBulletGoodBoy2);
  and inst120 (inst120_out, validBullet3, validBulletGoodBoy2);
  CONSTX #(.size(10), .\const (10)) inst34 (.data(inst34_data));
  and inst74 (inst74_out, validBullet2, validBulletGoodBoy1);
  and inst75 (inst75_out, validBullet2, validBulletGoodBoy2);
  and inst76 (inst76_out, validBullet2, validBulletGoodBoy3);
  and inst104 (inst104_out, validBullet5, validBulletGoodBoy1);
  and inst105 (inst105_out, validBullet5, validBulletGoodBoy2);
  and inst106 (inst106_out, validBullet5, validBulletGoodBoy3);
  and inst139 (inst139_out, validBullet1, validBulletGoodBoy5);
  and inst140 (inst140_out, validBullet2, validBulletGoodBoy5);
  and inst141 (inst141_out, validBullet3, validBulletGoodBoy5);
  and inst142 (inst142_out, validBullet4, validBulletGoodBoy5);
  and inst143 (inst143_out, validBullet5, validBulletGoodBoy5);
  not inst148 (inst148_out, PixelNotValid);
  ADD10 inst35 (.A(ycoup), .B(ycodo), .F(f), .C10(c));  // open: C0
  SUBX #(.size(10)) inst31 (.A({c, f[9:1]}), .B(inst34_data), .C(ycorst));
  BulletShapeBadBoy inst2 (
    .CLK(CLK), .currentx(bulletx), .currenty(bullety), .x(x), .y(y), .R(RBadBoy), .G(GBadBoy), .B(BBadBoy),
    .validBulletShape(inst2_validbulletshape));
  BulletShapeGoodBoy inst5 (
    .CLK(CLK), .currentx(bulletGoodBoyx), .currenty(bulletGoodBoyy), .x(x), .y(y), .R(RGoodBoy),
    .G(GGoodBoy), .B(BGoodBoy), .validBulletShape(inst5_validbulletshape));
  or inst123 (inst123_out, inst118_out, inst119_out, inst120_out, inst121_out, inst122_out);
  MP5X #(.size(10)) inst24 (
    .X0(bullet1x), .X1(bullet2x), .X2(bullet3x), .X3(bullet4x), .X4(bullet5x), .S0(Z0), .S1(Z1), .S2(Z2),
    .Y(bulletx));
  MP5X #(.size(10)) inst42 (
    .X0(bullet1y), .X1(bullet2y), .X2(bullet3y), .X3(bullet4y), .X4(bullet5y), .S0(Z0), .S1(Z1), .S2(Z2),
    .Y(bullety));
  and inst93 (restartGoodBoy1, validPlayer, collision, validBulletGoodBoy1);
  and inst94 (restartGoodBoy2, validPlayer, collision, validBulletGoodBoy2);
  and inst95 (restartGoodBoy3, validPlayer, collision, validBulletGoodBoy3);
  MP5X #(.size(10)) inst63 (
    .X0(bullet1GoodBoyx), .X1(bullet2GoodBoyx), .X2(bullet3GoodBoyx), .X3(bullet4GoodBoyx),
    .X4(bullet5GoodBoyx), .S0(ZB0), .S1(ZB1), .S2(ZB2), .Y(bulletGoodBoyx));
  MP5X #(.size(10)) inst64 (
    .X0(bullet1GoodBoyy), .X1(bullet2GoodBoyy), .X2(bullet3GoodBoyy), .X3(bullet4GoodBoyy),
    .X4(bullet5GoodBoyy), .S0(ZB0), .S1(ZB1), .S2(ZB2), .Y(bulletGoodBoyy));
  or inst79 (inst79_out, inst74_out, inst75_out, inst76_out, inst77_out, inst78_out);
  or inst109 (inst109_out, inst104_out, inst105_out, inst106_out, inst107_out, inst108_out);
  pCD inst26 (
    .I4(validBullet5), .I3(validBullet4), .I2(validBullet3), .I1(validBullet2), .I0(validBullet1), .E(1'b1),
    .Z0(Z0), .Z1(Z1), .Z2(Z2), .W(anyActive));
  and inst89 (collision, inst148_out, validPlayer, validBulletShapeGoodBoy);
  pCD inst38 (
    .I4(validBulletGoodBoy5), .I3(validBulletGoodBoy4), .I2(validBulletGoodBoy3), .I1(validBulletGoodBoy2),
    .I0(validBulletGoodBoy1), .E(1'b1), .Z0(ZB0), .Z1(ZB1), .Z2(ZB2), .W(anyActiveG));
  or inst144 (inst144_out, inst139_out, inst140_out, inst141_out, inst142_out, inst143_out);
  and inst124 (deleteBulletGoodBoy2, collisionBullets, inst123_out);
  and inst80 (deleteBullet2, collisionBullets, inst79_out);
  and inst110 (deleteBullet5, collisionBullets, inst109_out);
  and inst145 (deleteBulletGoodBoy5, collisionBullets, inst144_out);
  and inst11111 (validBulletShapeBadBoy, inst2_validbulletshape, anyActive, validBulletBadBoy);
  and inst767 (validBulletShapeGoodBoy, inst5_validbulletshape, anyActiveG, validBulletGoodBoy);
  and inst96 (restartGoodBoy4, validPlayer, collision, validBulletGoodBoy4);
  and inst97 (restartGoodBoy5, validPlayer, collision, validBulletGoodBoy5);
  and inst127 (inst127_out, validBullet3, validBulletGoodBoy3);
  and inst128 (inst128_out, validBullet4, validBulletGoodBoy3);
  and inst129 (inst129_out, validBullet5, validBulletGoodBoy3);
  and inst83 (inst83_out, validBullet3, validBulletGoodBoy3);
  and inst84 (inst84_out, validBullet3, validBulletGoodBoy4);
  and inst85 (inst85_out, validBullet3, validBulletGoodBoy5);
  and inst125 (inst125_out, validBullet1, validBulletGoodBoy3);
  and inst126 (inst126_out, validBullet2, validBulletGoodBoy3);
  and inst81 (inst81_out, validBullet3, validBulletGoodBoy1);
  and inst82 (inst82_out, validBullet3, validBulletGoodBoy2);
  or inst130 (inst130_out, inst125_out, inst126_out, inst127_out, inst128_out, inst129_out);
  pCD inst186 (
    .I3(validHearth), .I2(validBulletShapeBadBoy), .I1(validBulletShapeGoodBoy), .I0(validPlayer), .E(1'b1),
    .Z0(d0), .Z1(d1), .Z2(d2));  // open: I4, W
  pCD inst16 (
    .I4(endOfScreen5), .I3(endOfScreen4), .I2(endOfScreen3), .I1(endOfScreen2), .I0(endOfScreen1), .E(1'b1),
    .Z0(inst16_z0), .Z1(inst16_z1), .Z2(inst16_z2), .W(inst16_w));
  or inst86 (inst86_out, inst81_out, inst82_out, inst83_out, inst84_out, inst85_out);
  and inst131 (deleteBulletGoodBoy3, collisionBullets, inst130_out);
  REGX #(.size(1), .default_value(0)) inst159 (.data_in(1'b1));  // open: clk, ld, cl, inc, dec, data_out
  REGX #(.size(1), .default_value(0)) inst17 (
    .clk(CLK), .ld(inst16_w), .cl(GoodBoyFinishedReading), .data_in(1'b1), .data_out(ICanSendData));  // open: inc, dec
  not inst45 (inst45_out, youCanReadGoodBoy);
  and inst87 (deleteBullet3, collisionBullets, inst86_out);
  MP5X #(.size(4)) inst165 (
    .X0(currentPixel[15:12]), .X1(RGoodBoy), .X2(RBadBoy), .X3(RH), .S0(d0), .S1(d1), .S2(d2), .Y(R));  // open: X4
  MP5X #(.size(4)) inst168 (
    .X0(currentPixel[11:8]), .X1(GGoodBoy), .X2(GBadBoy), .X3(GH), .S0(d0), .S1(d1), .S2(d2), .Y(G));  // open: X4
  MP5X #(.size(4)) inst169 (
    .X0(currentPixel[7:4]), .X1(BGoodBoy), .X2(BBadBoy), .X3(BH), .S0(d0), .S1(d1), .S2(d2), .Y(B));  // open: X4
  MP5X #(.size(10)) inst48 (
    .X0(bullet1y), .X1(bullet2y), .X2(bullet3y), .X3(bullet4y), .X4(bullet5y), .S0(inst16_z0),
    .S1(inst16_z1), .S2(inst16_z2), .Y(inst48_y));
  DFF inst52 (.CLK(CLK), .D(inst45_out), .Q(inst52_q));  // open: CLRN, PRN
  REGX #(.size(1), .default_value(0)) inst41 (
    .clk(CLK), .ld(youCanReadGoodBoy), .cl(inst52_q), .data_in(1'b1), .data_out(BadBoyFinishedReading));  // open: inc, dec
  REGX #(.size(10), .default_value(0)) inst18 (
    .clk(CLK), .ld(inst16_w), .cl(GoodBoyFinishedReading), .data_in(inst48_y), .data_out(sendBullet));  // open: inc, dec
  and inst72 (collisionBullets, validBulletShapeBadBoy, validBulletShapeGoodBoy);
  healthStatus inst100 (
    .gotHit(collision), .xValue(x), .yValue(y), .CLK(CLK), .restartHealth(restart), .valid(validHearth),
    .isDead(inst100_isdead), .R(RH), .G(GH), .B(BH));
  not inst67 (inst67_out, PixelNotValid);
  not inst66 (inst66_out, validPlayer);
  DFF inst65 (.CLK(CLK), .D(validPlayer), .Q(inst65_q));  // open: CLRN, PRN
  and inst19 (inst19_out, inst67_out, validPlayer);
  and inst68 (inst68_out, inst66_out, inst65_q);
  RisingEdge inst162 (.clk(CLK), .in_signal(inst100_isdead), .out_signal(inst162_out_signal));
  or inst101 (valid, validBulletShapeGoodBoy, inst19_out, validBulletShapeBadBoy, validHearth);
  or inst182 (inst182_out, inst68_out, resReg);
  REGX #(.size(1), .default_value(1)) inst175 (
    .clk(CLK), .ld(inst182_out), .cl(canReadPixels), .data_in(1'b1), .data_out(canReadPixels));  // open: inc, dec
  REGX #(.size(1), .default_value(0)) inst161 (
    .clk(CLK), .ld(inst162_out_signal), .cl(restart), .data_in(1'b1), .data_out(iAmDead));  // open: inc, dec
  MemoryController inst147 (
    .CLK(CLK), .startRead(canReadPixels), .startSending(validPlayer), .clr(resReg), .LDQM(LDQM), .UDQM(UDQM),
    .A(A), .BA0(BA0), .BA1(BA1), .nWE(nWE), .nCAS(nCAS), .nRAS(nRAS), .nCS(nCS), .CLKin(CLK_in), .CKE(CKE),
    .pixelColor(currentPixel), .DQout(DQ));
  CMPX #(.size(16)) inst151 (.A(currentPixel), .B(inst152_data), .eq(PixelNotValid));  // open: ls, gr
  CONSTX #(.size(16), .\const (4383)) inst152 (.data(inst152_data));

  // Notes on the sheet:
  //   Salje kontrole za Igraca
  //   Odredjuje pocetnu poziciju metka na ekranu                                                        
  //   Odlucuje sta treba da se crta na ekranu      
  //   Na osnovu toga koji je isplajeni metak aktiviran, salje taj metak na iscrtavanje                                                                  
  //   Odredjuje da li treba da se isplai metak, odnosno da li je pritisnut i otpusten space                                
  //   Registri koji vode racuna o isplaljenim metkovima                       
  //   Proverava da li treba crtati nesto iz GameScreen bloka                                                                                                                                                          
  //   Odredjuje da li je ispaljeni metak dosao do kraja ekrana i ako jeste, salje signal drugom igracu. da treba da procita podatak, i ucitava koordinate metka koje drugi igrac treba da prihvati          
  //   Odlucuje u koji regisat treba upisat ispaljeni metak, i da li je dozvoljeno ispaliti metak, odnosno da li su svi registri za metkove zauzeti
  //   Vodi racuna o crtanju srca, health bar-a,  i da li je igra gotova                           
  //   Obavestava drugog igraca da je prihvatio njegove podatke i da moze da prestane da ih salje.
  //   Proverava da li je doslo do sudara izmedju igraca i primljenog metka
  //   Proverava da li je neki ispaljeni metak trenutno aktivan za iscrtavanje                                         
  //   Registri koji vode racuna o primljenim metkovima                   
  //   Odlucuje u koji registar upisati primljeni metak, treba;o bi da uvek moze da bude prinmljen
  //   Na osnovu toga koji je primljeni metak aktivan za crtanje, salje taj metak na iscrtavanje u BulletShape
  //   1
  //   Proverava da li se neki primljeni metak trenutno crta                                 
  //   Proverava da li je doslo do sudara izmedju dva metka, i ako jeste aktivira signal za deaktoivaciju odgovarajacih metkova
endmodule
